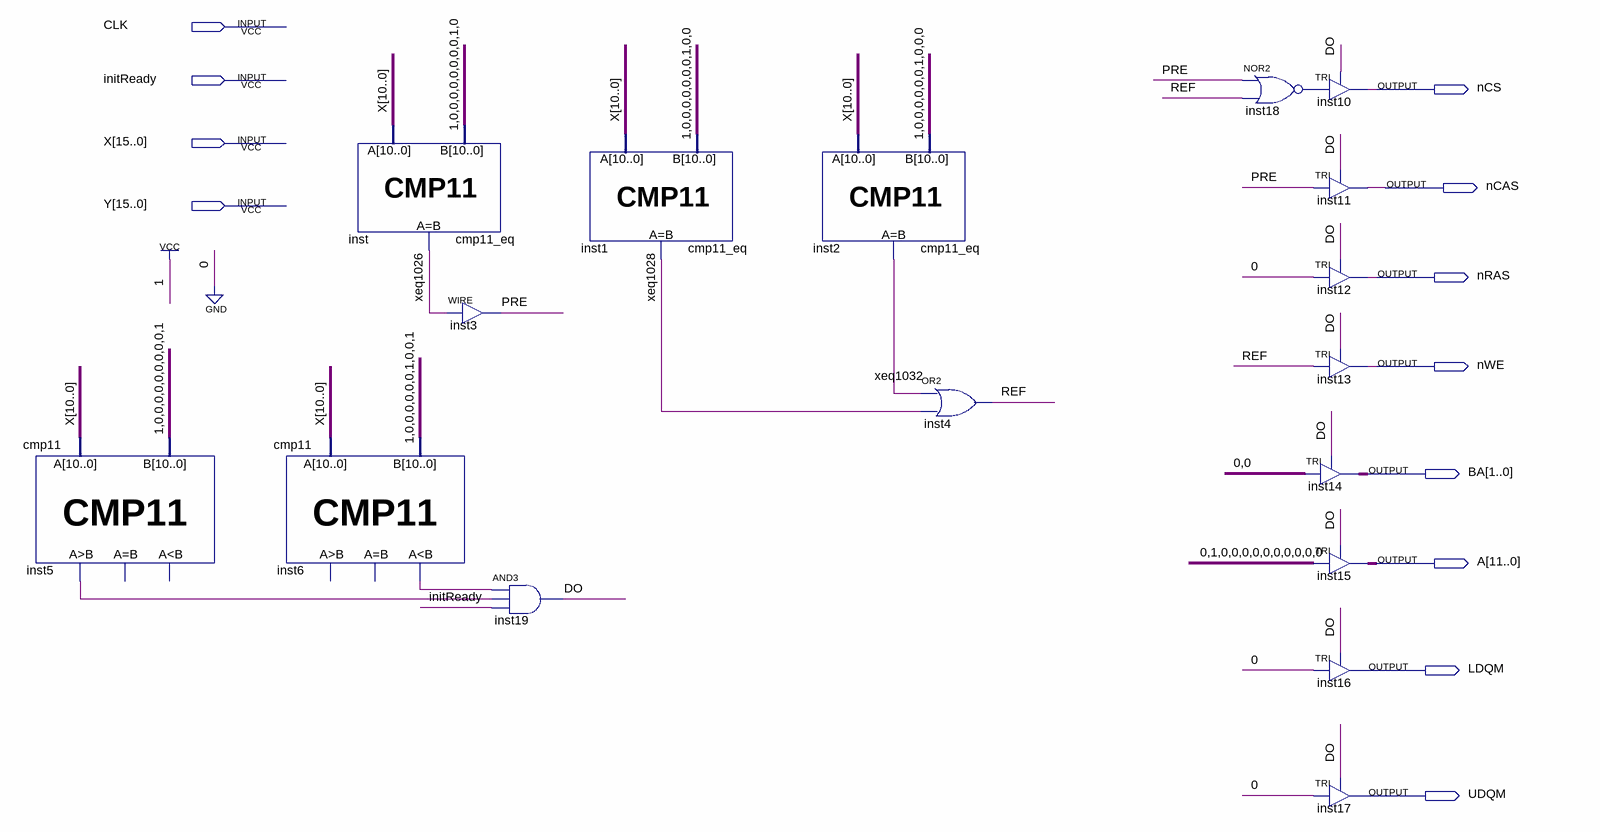
[diagram p0: schematic sheet]
// Quartus schematic AUTO_REFRESH.bdf as structural Verilog: 17 symbols, 12 pins
module AUTO_REFRESH (
  input  CLK,
  input  initReady,
  input  [15:0] X,
  input  [15:0] Y,
  output nCS,
  output nCAS,
  output nRAS,
  output nWE,
  output [1:0] BA,
  output [11:0] A,
  output LDQM,
  output UDQM
);

  wire DO, inst5_gt, inst6_ls, inst18_out, PRE, REF, xeq1026, xeq1028, xeq1032;

  cmp11 inst5 (.A(X[10:0]), .B(11'b10000000001), .Gt(inst5_gt));  // open: Ls, Eq
  cmp11 inst6 (.A(X[10:0]), .B(11'b10000001001), .Ls(inst6_ls));  // open: Eq, Gt
  cmp11_eq inst (.A(X[10:0]), .B(11'b10000000010), .eq(xeq1026));
  assign PRE = xeq1026;  // WIRE inst3
  and inst19 (DO, inst6_ls, inst5_gt, initReady);
  cmp11_eq inst1 (.A(X[10:0]), .B(11'b10000000100), .eq(xeq1028));
  cmp11_eq inst2 (.A(X[10:0]), .B(11'b10000001000), .eq(xeq1032));
  or inst4 (REF, xeq1032, xeq1028);
  nor inst18 (inst18_out, PRE, REF);
  TRI inst10 (.IN(inst18_out), .OE(DO), .OUT(nCS));
  TRI inst11 (.IN(PRE), .OE(DO), .OUT(nCAS));
  TRI inst12 (.IN(1'b0), .OE(DO), .OUT(nRAS));
  TRI inst13 (.IN(REF), .OE(DO), .OUT(nWE));
  TRI inst14[1:0] (.IN(2'b00), .OE(DO), .OUT(BA));
  TRI inst15[11:0] (.IN(12'b010000000000), .OE(DO), .OUT(A));
  TRI inst16 (.IN(1'b0), .OE(DO), .OUT(LDQM));
  TRI inst17 (.IN(1'b0), .OE(DO), .OUT(UDQM));
endmodule
